# EAGLE design Dianome (EAGLE 9.6.2)
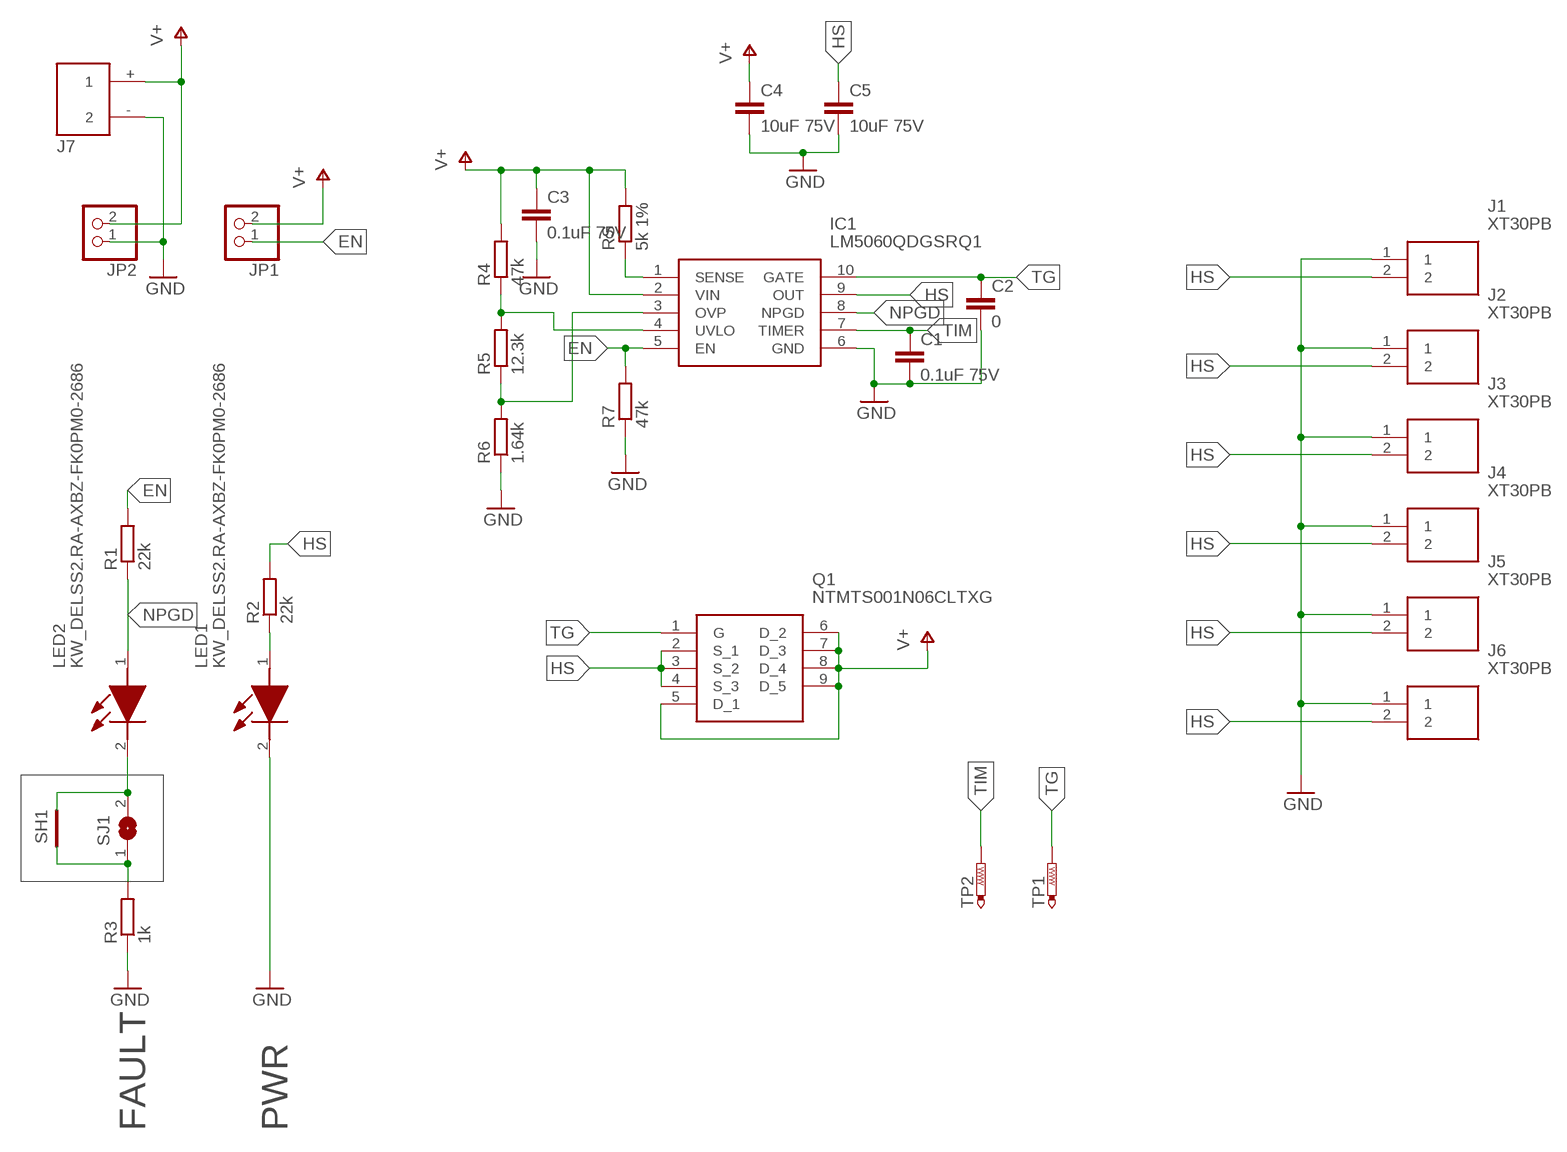
[diagram p0: schematic, sheet 1]

## Parts
C1  0.1uF 75V  C-EUC0603K  [C0603K]
C2  0  C-EUC0603K  [C0603K]
C3  0.1uF 75V  C-EUC0603K  [C0603K]
C4  10uF 75V  C-EUC1210  [C1210]
C5  10uF 75V  C-EUC1210  [C1210]
IC1  LM5060QDGSRQ1  [SOP50P490X110-10N]
J1  XT30PB  [XT30PB]
J2  XT30PB  [XT30PB]
J3  XT30PB  [XT30PB]
J4  XT30PB  [XT30PB]
J5  XT30PB  [XT30PB]
J6  XT30PB  [XT30PB]
J7  XT60_FEMALE  [XT60_FEMALE]
JP1  PINHD-1X02_2.54-S  [1X02-S]
JP2  PINHD-1X02_2.54-S  [1X02-S]
LED1  KW_DELSS2.RA-AXBZ-FK0PM0-2686  [KWDELSS2RAAXBZFK0PM02686]
LED2  KW_DELSS2.RA-AXBZ-FK0PM0-2686  [KWDELSS2RAAXBZFK0PM02686]
Q1  NTMTS001N06CLTXG  [NTMTS001N06CLTXG]
R1  22k  R-EU_R0603  [R0603]
R2  22k  R-EU_R0603  [R0603]
R3  1k  R-EU_R0603  [R0603]
R4  47k  R-EU_R0603  [R0603]
R5  12.3k  R-EU_R0603  [R0603]
R6  1.64k  R-EU_R0603  [R0603]
R7  47k  R-EU_R0603  [R0603]
RS  5k 1%  R-EU_R0603  [R0603]
SH1  SHORTT5  [SHORT_TOP-50]
SJ1  SJ  [SJ]
TP1  PTR1PAD1-13  [P1-13]
TP2  PTR1PAD1-13  [P1-13]

## Nets
EN: IC1.5(EN) JP1.1 R1.2 R7.2
GND: C1.2 C2.2 C3.2 C4.2 C5.2 IC1.6(GND) J1.1 J2.1 J3.1 J4.1 J5.1 J6.1 J7.- JP2.1 LED1.2(K) R3.1 R6.1 R7.1
HS: C5.1 IC1.9(OUT) J1.2 J2.2 J3.2 J4.2 J5.2 J6.2 Q1.2(S_1) Q1.3(S_2) Q1.4(S_3) R2.2
N$1: LED1.1(A) R2.1
N$2: IC1.1(SENSE) RS.1
N$3: IC1.3(OVP) R5.1 R6.2
N$4: LED2.2(K) SH1.2 SJ1.2
N$5: IC1.4(UVLO) R4.1 R5.2
N$6: R3.2 SH1.1 SJ1.1
NPGD: IC1.8(NPGD) LED2.1(A) R1.1
TG: C2.1 IC1.10(GATE) Q1.1(G) TP1.1(TP)
TIM: C1.1 IC1.7(TIMER) TP2.1(TP)
V+: C3.1 C4.1 IC1.2(VIN) J7.+ JP1.2 JP2.2 Q1.5(D_1) Q1.6(D_2) Q1.7(D_3) Q1.8(D_4) Q1.9(D_5) R4.2 RS.2

## Notes on the sheet
- FAULT | PWR

## Library data of the parts
C1-C5 = rcl:C-EU: CAPACITOR, European symbol; SPICEPREFIX: C
IC1 = SamacSys_Parts:LM5060QDGSRQ1: High-Side Protection Controller with Low Quiescent Current Source: Datasheet <http://www.ti.com/lit/gpn/lm5060-q1>; ARROW_PART_NUMBER: LM5060QDGSRQ1; ARROW_PRICE-STOCK: https://www.arrow.com/en/products/lm5060qdgsrq1/texas-instruments; DESCRIPTION: High-Side Protection Controller with Low Quiescent Current; HEIGHT: 1.1mm; MANUFACTURER_NAME: Texas Instruments; MANUFACTURER_PART_NUMBER: LM5060QDGSRQ1; MOUSER_PART_NUMBER: 595-LM5060QDGSRQ1; MOUSER_PRICE-STOCK: https://www.mouser.co.uk/ProductDetail/Texas-Instruments/LM5060QDGSRQ1?qs=rrS6PyfT74fofYTH%2FXzYhg%3D%3D
J1-J6 = SamacSys_Parts:XT30PB: Mini XT60 XT30 Connector for RC Multirotor Racing Drone Quadcopter Source: Datasheet <https://www.tme.eu/Document/4acc913878197f8c2e30d4b8cdc47230/XT30UPB SPEC.pdf>; DESCRIPTION: Mini XT60 XT30 Connector for RC Multirotor Racing Drone Quadcopter; HEIGHT: 10.7mm; MANUFACTURER_NAME: Amass; MANUFACTURER_PART_NUMBER: XT30PB
J7 = Tristan+Robitaille's+Library:XT60_FEMALE: Vertical Mount Through-Hole Female (receptacle) XT60 Connector
JP1 JP2 = pinhead-2:PINHD-1X02: PIN HEADER
LED1 LED2 = SamacSys_Parts:KW_DELSS2.RA-AXBZ-FK0PM0-2686: Standard LEDs - SMD White TOPLED E 1608 Source: Datasheet <https://media.osram.info/media/resource/hires/osram-dam-5357464/KW DELSS2.RA_EN.pdf>; ARROW_PART_NUMBER: KW DELSS2.RA-AXBZ-FK0PM0-2686; ARROW_PRICE-STOCK: https://www.arrow.com/en/products/kw-delss2.ra-axbz-fk0pm0-2686/osram-opto-semiconductors; DESCRIPTION: Standard LEDs - SMD White TOPLED E 1608; HEIGHT: 0.7mm; MANUFACTURER_NAME: OSRAM; MANUFACTURER_PART_NUMBER: KW DELSS2.RA-AXBZ-FK0PM0-2686; MOUSER_PART_NUMBER: 720-KWDELSS2RAA6162; MOUSER_PRICE-STOCK: https://www.mouser.co.uk/ProductDetail/OSRAM-Opto-Semiconductors/KW-DELSS2RA-AXBZ-FK0PM0-2686?qs=XeJtXLiO41TUPblfTc2m%252Bw%3D%3D
Q1 = SamacSys_Parts:NTMTS001N06CLTXG: MOSFET T6 60V LL PQFN8*8 EXPANSI Power MOSFET 60 V, 0.81 m, 398.2 A, Single NChannel Source: Datasheet <https://docs.rs-online.com/b547/0900766b816e75a5.pdf>; ARROW_PART_NUMBER: NTMTS001N06CLTXG; ARROW_PRICE-STOCK: https://www.arrow.com/en/products/ntmts001n06cltxg/on-semiconductor; DESCRIPTION: MOSFET T6 60V LL PQFN8*8 EXPANSI Power MOSFET 60 V, 0.81 m, 398.2 A, Single NChannel; HEIGHT: 1.2mm; MANUFACTURER_NAME: ON Semiconductor; MANUFACTURER_PART_NUMBER: NTMTS001N06CLTXG; MOUSER_PART_NUMBER: 863-NTMTS001N06CLTXG; MOUSER_PRICE-STOCK: https://www.mouser.co.uk/ProductDetail/ON-Semiconductor/NTMTS001N06CLTXG?qs=%252BEew9%252B0nqrCy6lrzfCYyhw%3D%3D
R1-R7 RS = rcl:R-EU_: RESISTOR, European symbol; SPICEPREFIX: R
SH1 = shorts:SHORT: Short between two nets; BOM: no
SJ1 = jumper:SJ: SMD solder JUMPER
TP1 TP2 = testpad:PTR1: TEST PIN

## Board
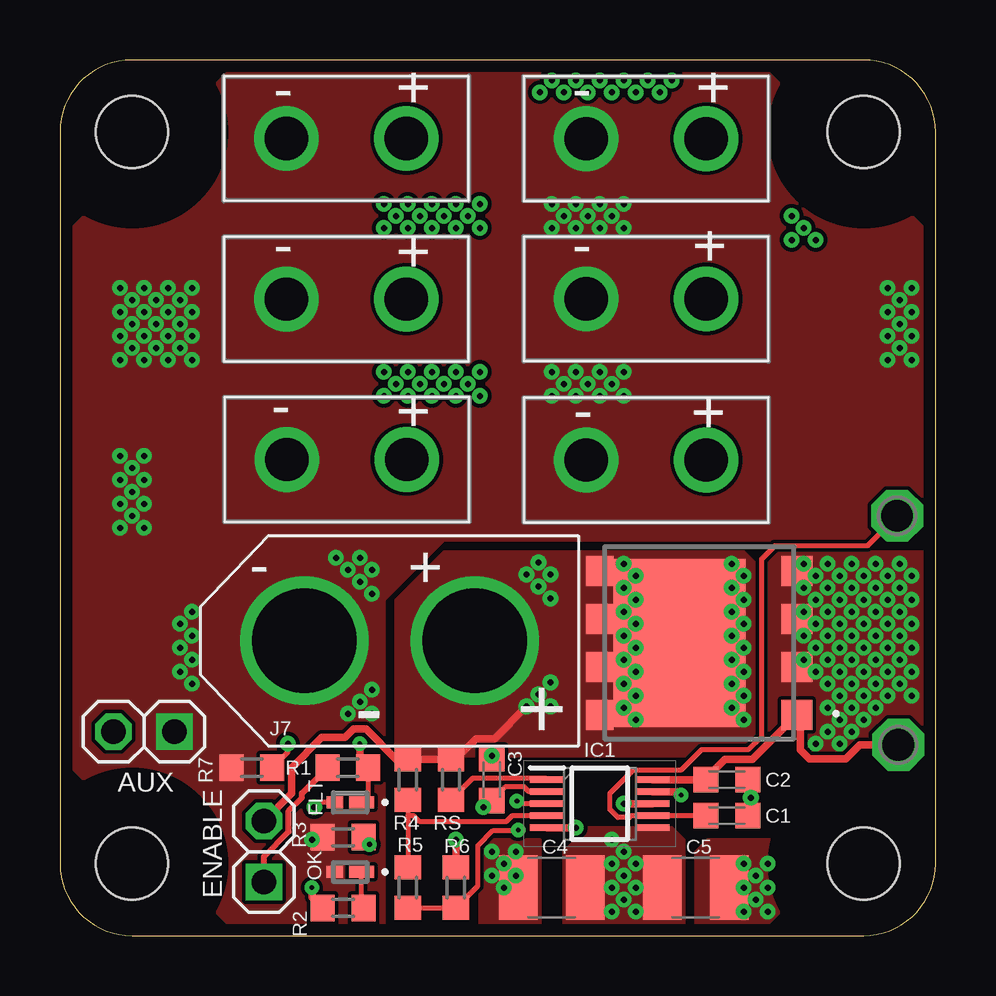
[diagram p1: board, top side]
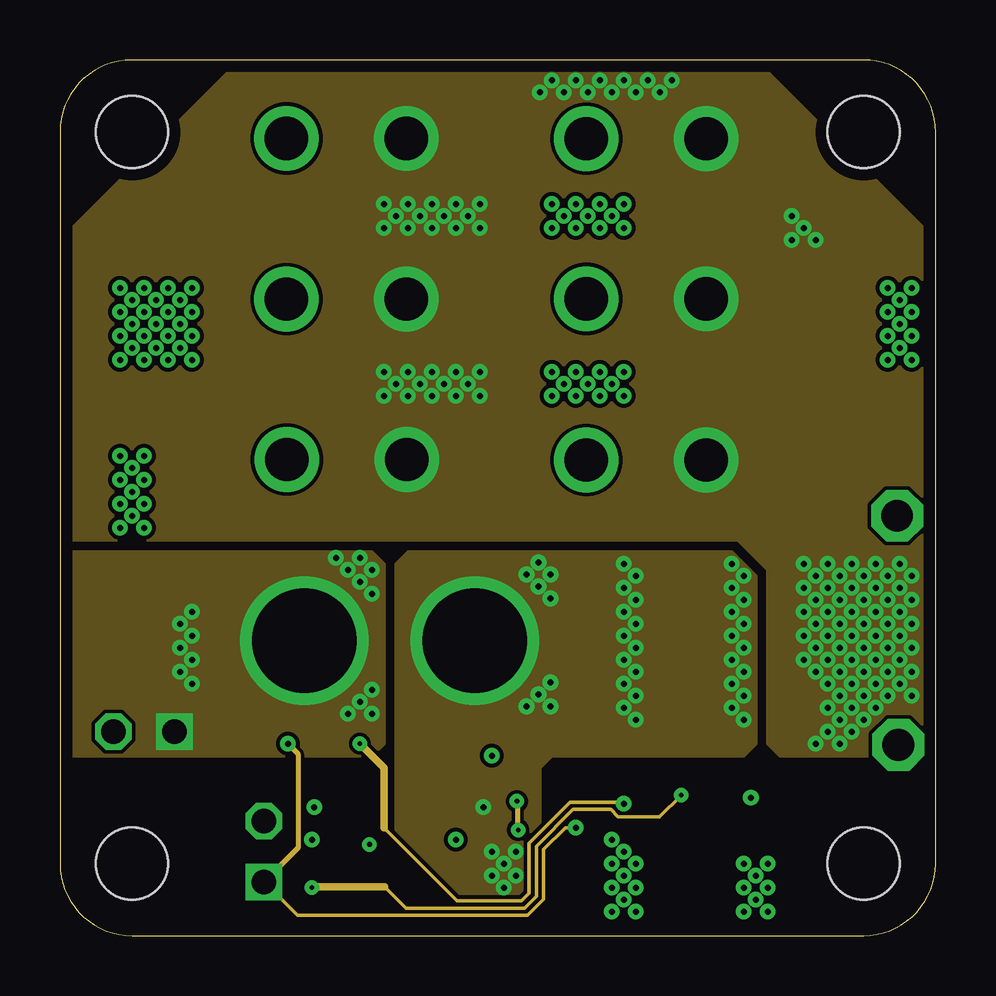
[diagram p2: board, inner layer Route2]
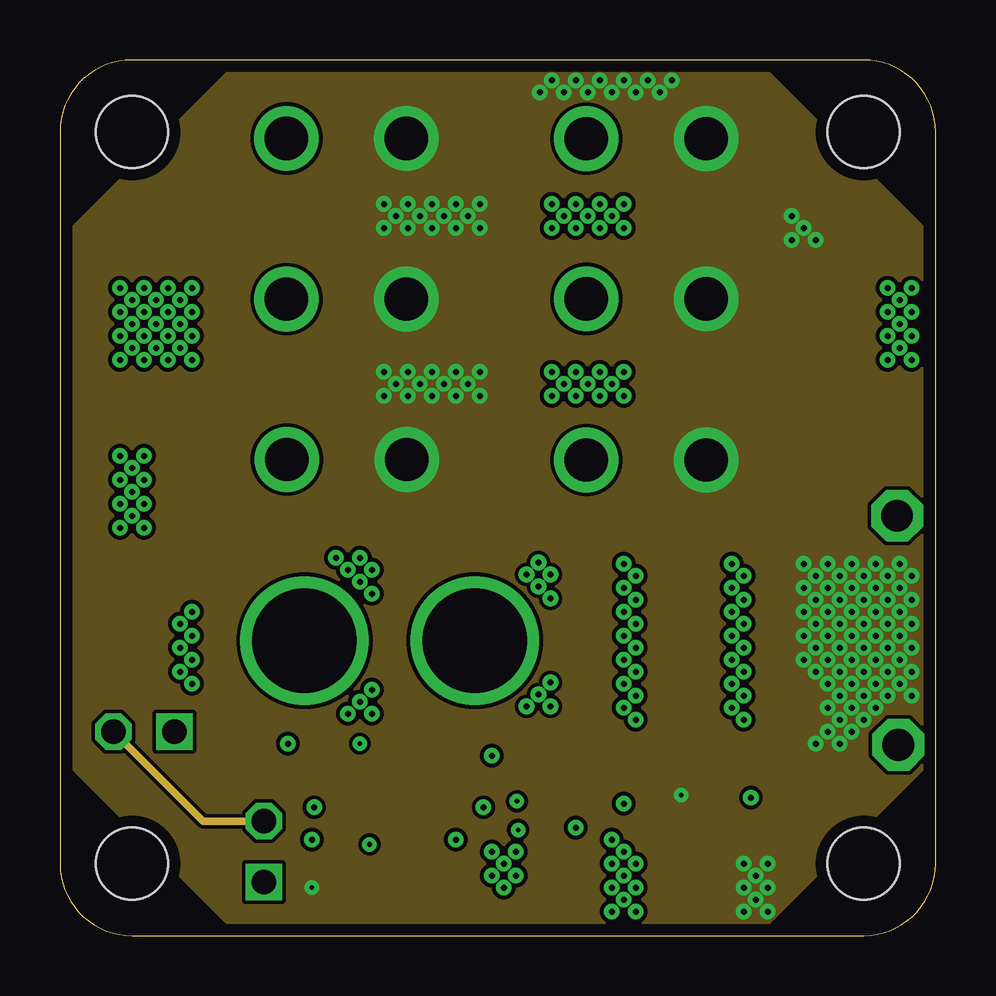
[diagram p3: board, inner layer Route15]
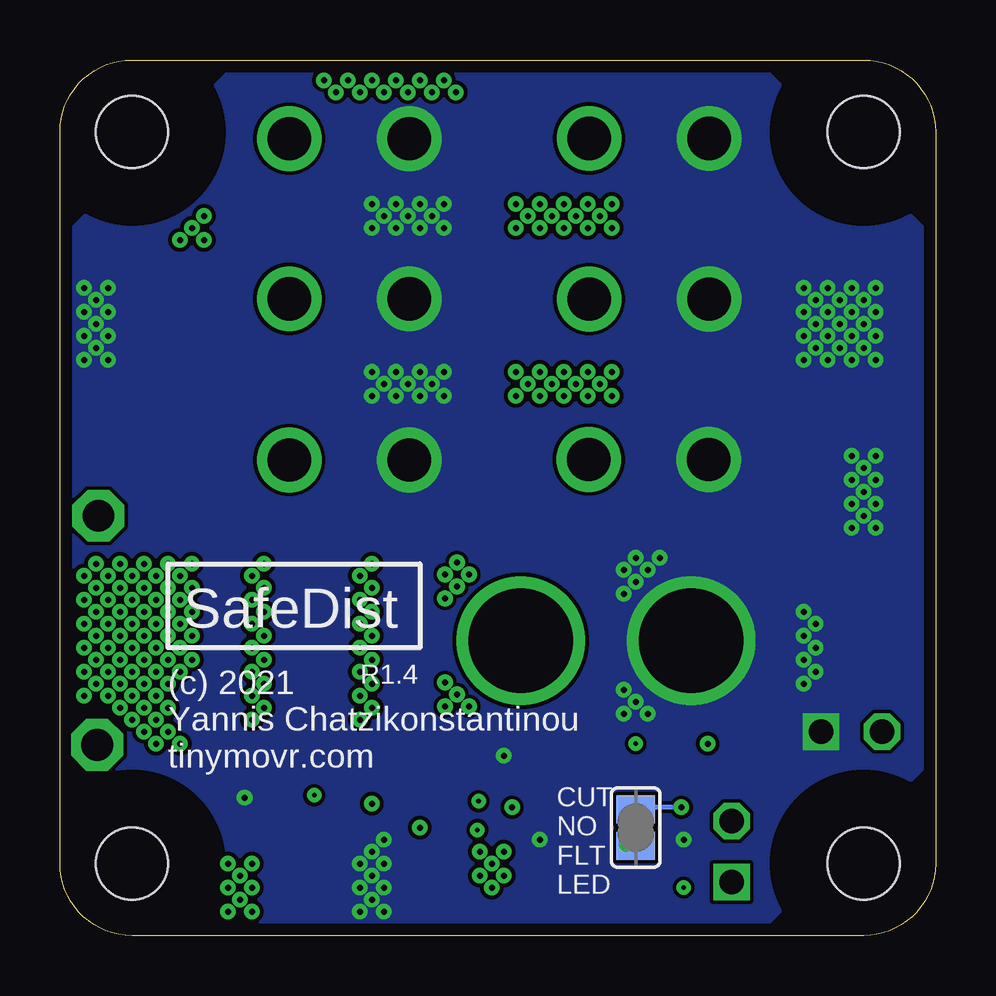
[diagram p4: board, bottom side, seen from below]

Size 36.5 x 36.5 mm. Coordinates in mm from the lower left corner, seen from the top.
Outline: 0,33.5 0,3 arc90 3,0 33.5,0 arc90 36.5,3 36.5,33.5 arc90 33.5,36.5 3,36.5 arc90 0,33.5
Copper layers (1+2*15+16): Top 0.035mm / dielectric 0.15mm / Route2 0.035mm / dielectric 1.5mm / Route15 0.035mm / dielectric 0.2mm / Bottom 0.035mm
Design rules "default *": minimum track width 6mil, minimum drill 0.2mm, track to track 6mil, track to pad 6mil, pad to pad 6mil, via to via 6mil, smd to smd 6mil, copper to edge 0.5mm, drill to drill 6mil, minimum pad ring 10mil, minimum via ring 8mil, stop-mask expansion 1mil, vias tented up to drill 5mm, thermal gap 10mil
Holes 3 mm at 3,3 33.5,3 33.5,33.5 3,33.5
tRestrict: area -1,-1 to 7,7; area 29.5,-1 to 37.5,7; area 29.5,29.5 to 37.5,37.5; area -1,29.5 to 7,37.5
bRestrict: area -0.9,29.6 to 6.9,37.4; area 29.6,29.6 to 37.4,37.4; area 29.6,-0.9 to 37.4,6.9; area -0.9,-0.9 to 6.9,6.9

### Footprints (pad centres in the part's own frame; a part is rotated, then mirrored left to right if it is on the bottom)
C0603K = smd 1.05 x 1.08: 1 -0.875,0; 2 0.875,0
C1210 = smd 1.6 x 2.7: 1 -1.4,0; 2 1.4,0
SOP50P490X110-10N = smd 1.4 x 0.279: 1 -2.2,1; 2 -2.2,0.5; 3 -2.2,0; 4 -2.2,-0.5; 5 -2.2,-1; 6 2.2,-1; 7 2.2,-0.5; 8 2.2,0; 9 2.2,0.5; 10 2.2,1
XT30PB = drill 1.8 pad 2.7: 1 0,0; 2 0,-5
XT60_FEMALE = drill 4.35: + 3.55,0; - -3.55,0
1X02-S = drill 1.016 square: 1 -1.27,0 | drill 1.016 octagon: 2 1.27,0
KWDELSS2RAAXBZFK0PM02686 = smd 1.05 x 0.5: 1 0.47,0 | smd 0.7 x 0.5: 2 -0.645,0
NTMTS001N06CLTXG = smd 1.25 x 1.28: 1 -3,-4.07; 2 -1,-4.07; 3 1,-4.07; 4 3,-4.07 | smd 1.25 x 1.15: 5 3,4.145; 6 1,4.145; 7 -1,4.145; 8 -3,4.145 | smd 7 x 5.5: 9 0,0.82
R0603 = smd 1 x 1.1: 1 -0.85,0; 2 0.85,0
SHORT_TOP-50 = smd 0.254 x 0.254: 1 0.127,0; 2 -0.127,0
SJ = smd 1.168 x 1.6: 1 -0.762,0; 2 0.762,0
P1-13 = drill 1.321 pad 2.159 octagon: 1 0,0

### Placement (x,y rotation side)
C1  27.8,5 0 top
C2  27.8,6.5 0 top
C3  18,6.5 90 top
C4  20.5,2 0 top
C5  26.5,2 180 top
IC1  22.5,5.5 0 top
J1  9.46,19.84 90 top
J2  21.94,19.82 90 top
J3  9.44,26.53 90 top
J4  21.94,26.54 90 top
J5  21.94,33.22 90 top
J6  9.44,33.23 90 top
J7  13.74,12.29 0 top
JP1  8.5,3.5 90 top
JP2  3.5,8.5 180 top
LED1  12.1,2.65 0 top
LED2  12.1,5.55 0 top
Q1  26.65,12.2 90 top
R1  12,7 180 top
R2  11.8,1.15 180 top
R3  11.8,4.1 0 top
R4  14.5,6.5 90 top
R5  14.5,2 90 top
R6  16.5,2 270 top
R7  8,7 0 top
RS  16.3,6.5 90 top
SH1  12.5,4.5 270 bottom
SJ1  12.5,4.5 90 bottom
TP1  34.95,7.95 0 top
TP2  34.9,17.5 0 top

### Tracks (layer width: path | path; a pad name or v marks a point on that pad's centre or on a via)
EN  (via drill 0.25)
  Top 0.2: R7.2 9.5,7.65 v9.5,8
  Top 0.254: R1.2 10.09,5.94 10.09,5.75 9.54,5.2 9.54,4.34 8.5,3.3 JP1.1
  Top 0.305: IC1.5 v21.5,4.5
  Route2 0.152: v21.5,4.5 21.07,4.5 20.17,3.59 20.17,1.52 19.48,0.83 9.9,0.83 JP1.1
  Route2 0.2: v9.5,8 9.92,7.58 9.92,3.65 JP1.1
GND  (via drill 0.25)
  Top 0.305: C2.2 28.8,6.38 v28.8,5.75 28.8,5.12 C1.2 | R6.1 v16.5,4 | C3.2 v18,7.5
  other vias: 5.5,13.5 5,13 5.5,12.5 5,12 5.5,11.5 5,11 5.5,10.5 12.5,15.75 13,15.25 12.5,14.75 12,15.25 11.5,15.75 13,14.25 13,9.25 13,10.25 12.5,9.75 12,9.25 20.5,30.5 21,30 21.5,30.5 22,30 22.5,30.5 23,30 23.5,30.5 23.5,29.5 22.5,29.5 21.5,29.5 20.5,29.5 21,23 20.5,23.5 20.5,22.5 21.5,22.5 22,23 22.5,22.5 23,23 23.5,22.5 23.5,23.5 22.5,23.5 21.5,23.5 3.5,17 3.5,18 3.5,19 3.5,20 3,19.5 2.5,20 2.5,19 3,18.5 2.5,18 3,17.5 2.5,17 5.5,27 5,26.5 5.5,26 5,25.5 5.5,25 5,24.5 5.5,24 4.5,24 4.5,25 4.5,26 4.5,27 4,26.5 4,25.5 4,24.5 3.5,24 3.5,25 3.5,26 3.5,27 3,26.5 2.5,27 2.5,26 3,25.5 2.5,25 3,24.5 2.5,24 35.5,27 35,26.5 35.5,26 35,25.5 35.5,25 35,24.5 35.5,24 34.5,24 34.5,25 34.5,26 34.5,27 24,1 24,2 24,3 23.5,3.5 23,4 23,3 23.5,2.5 23,2 23.5,1.5 23,1 10.5,4
  pour Top (no thermals): 7.5,36.5 0,29 0,7.5 7.5,0 13.5,0 13.5,14 16,16.5 36.5,16.5 36.5,29 29,36.5
  pour Top (no thermals): 21,0.5 21,3.5 22,4.5 25.5,4.5 26,4 26,0 21,0
  pour Bottom (no thermals): 7.5,0 0,7.5 0,29 7.5,36.5 29,36.5 36.5,29 36.5,7.5 29,0
  pour Route2 (no thermals): 13,16 13.5,15.5 13.5,8 13,7.5 0.5,7.5 0,8 0,15.5 0.5,16
HS  (via drill 0.2, 0.25)
  Top 0.305: IC1.9 25.75,6 v25.9,5.85 | R2.2 10.5,1.6 v10.5,2
  Route2 0.152: v25.9,5.85 24.99,4.94 23.27,4.94 22.96,5.25 21.4,5.25 19.86,3.72 19.86,1.64 19.36,1.14 14.43,1.14 13.53,2.03
  Route2 0.305: 13.53,2.03 10.53,2.03 v10.5,2
  other vias: 31,29.5 30.5,30 31.5,29 30.5,29 13.5,23.5 14,23 14.5,23.5 13.5,22.5 14.5,22.5 15,23 15.5,22.5 16,23 16.5,22.5 15.5,23.5 16.5,23.5 14,30 13.5,30.5 13.5,29.5 14.5,29.5 14.5,30.5 15,30 15.5,30.5 15.5,29.5 16,30 16.5,29.5 16.5,30.5 20.5,35.65 21.5,35.65 22.5,35.65 23,35.15 22,35.15 21,35.15 20,35.15 23.5,35.65 24,35.15 17,30 17.5,30.5 17.5,29.5 17,23 17.5,23.5 17.5,22.5 24.5,35.65 25,35.15 25.5,35.65 28.5,3 29,2.5 29.5,3 28.5,2 29.5,2 29,1.5 29.5,1 28.5,1 32,15.5 32.5,15 33,15.5 33.5,15 34,15.5 34.5,15 35,15.5 35.5,15 35,14.5 34,14.5 33,14.5 33.5,14 32.5,14 32,14.5 32,13.5 33,13.5 34,13.5 34.5,14 35,13.5 35.5,14 35.5,13 34.5,13 33.5,13 32.5,13 33,12.5 34,12.5 35,12.5 34.5,12 33.5,12 32.5,12 32,12.5 32,11.5 33,11.5 34,11.5 35,11.5 35.5,12 35.5,11 34.5,11 33.5,11 32.5,11 31.5,12 31.5,13 31.5,14 31.5,15 31.5,11 32,10.5 33,10.5 34,10.5 35,10.5 35.5,10 34.5,10 33.5,10 32.5,10 32,9.5 33,9.5 34,9.5 33.5,9 32.5,9 32,8.5 33,8.5 32.5,8 31.5,8 31,15.5 31,14.5 31,13.5 31,12.5 31,11.5
  pour Top (no thermals): 30,16 29.5,15.5 29.5,8 30,7.5 36.5,7.5 36.5,16
  pour Top (no thermals): 26.5,0 26.5,3.5 27,4 30,4 30,1 29,0
  pour Route2 (no thermals): 7.5,36.5 0,29 0,17 0.5,16.5 28.25,16.5 29.5,15.25 29.5,8 30,7.5 36.5,7.5 36.5,29 29,36.5
  pour Route15 (no thermals): 7.5,36.5 0,29 0,7.5 7.5,0 29,0 36.5,7.5 36.5,29 29,36.5
N$1
  Top 0.2: R2.1 12.57,1.23 LED1.1
N$2
  Top 0.2: IC1.1 20.25,6.55 17.2,6.55 RS.1
N$3  (via drill 0.2)
  Top 0.2: R5.1 R6.2
  Top 0.203: IC1.3 19.15,5.5 v19.05,5.6 | R6.2 17.42,2.07 17.42,3.74 18.06,4.38 19.08,4.38 v19.1,4.4
  Route2 0.203: v19.1,4.4 19.1,5.55 v19.05,5.6
N$4  (via drill 0.25)
  Top 0.2: LED2.2 10.8,5.55 v10.6,5.35
  Bottom 0.2: v10.6,5.35 12.41,5.35 SJ1.2 SH1.2
N$5
  Top 0.2: R4.1 14.5,5 | 14.5,5 R5.2 | 14.5,5 14.74,5 14.99,4.75 18.59,4.75
  Top 0.203: IC1.4 18.85,5 18.59,4.75
N$6  (via drill 0.2)
  Top 0.152: R3.2 12.9,3.85
  Top 0.2: 12.9,3.85 v12.9,3.8
  Bottom 0.152: SH1.1 12.9,3.97 v12.9,3.8
  Bottom 0.2: SJ1.1 SH1.1
NPGD  (via drill 0.2, 0.25)
  Top 0.2: R1.1 12.85,5.83 LED2.1
  Top 0.305: IC1.8 v23.5,5.5 | R1.1 12.5,7.35 v12.5,8
  Route2 0.152: v23.5,5.5 23.44,5.56 21.27,5.56 19.56,3.84 19.56,1.77 19.23,1.44 16.56,1.44 13.5,4.5
  Route2 0.305: v12.5,8 13.5,7 13.5,4.5
TG
  Top 0.305: IC1.10 C2.1 26.93,6.55 27.72,7.34 28.86,7.34 Q1.1 30.87,9.05 30.87,7.74 31.24,7.37 32.76,7.37 33.34,7.95 TP1.1
TIM
  Top 0.2: C1.1 IC1.7
  Top 0.203: IC1.7 23.82,5 23.74,4.92 23.26,4.92 22.92,5.26 22.92,5.93 23.9,6.91 25.91,6.91 26.75,7.75 28.7,7.75 29.25,8.3 29.25,15.7 29.8,16.25 33.65,16.25 TP2.1
V+  (via drill 0.25)
  Top 0.2: C3.1 18.57,6.2 19.35,6.2 19.55,6 IC1.2
  Top 0.305: C3.1 17.73,5.35 v17.65,5.35 | v19.45,9.55 18.11,8.21 17.33,8.21 16.48,7.35 RS.2 R4.2 14.01,7.35 12.75,8.61 12.25,8.61 11.89,8.25 10.91,8.25 9.66,7 9.66,5.92 JP1.2
  Route15 0.305: JP2.2 5.96,4.77 JP1.2
  other vias: 20.45,14.05 19.95,14.55 20.45,15.05 19.95,15.55 19.45,15.05 20.45,10.55 19.95,10.05 20.45,9.55 28,15.5 23.5,15.5 24,15 23.5,14.5 24,14 23.5,13.5 24,13 23.5,12.5 24,12 23.5,11.5 24,11 23.5,10.5 24,10 23.5,9.5 24,9 28.5,15 28,14.5 28.5,14 28,13.5 28.5,13 28,12.5 28.5,12 28,11.5 28.5,11 28,10.5 28.5,10 28,9.5 28.5,9 19,3.5 18.5,2 19,2.5 18,2.5 18.5,3 18,3.5
  pour Top (no thermals): 16,16 14,14 14,8 14.5,7.5 28.5,7.5 29,8 29,15.5 28.5,16
  pour Route2 (no thermals): 14.5,16 14,15.5 14,0 20,0 20,7 20.5,7.5 28.5,7.5 29,8 29,15 28,16
  pour Top (no thermals): 20,4 18,4 17.5,3.5 17.5,0 20,0

### Text on the board
tNames: + | + | - | - | - | + | - | + | - | + | - | + | - | + | AUX | FLT | ENABLE | OK
bNames: SafeDist | R1.4 | (c) 2021 / Yannis Chatzikonstantinou / tinymovr.com | CUT / NO / FLT / LED